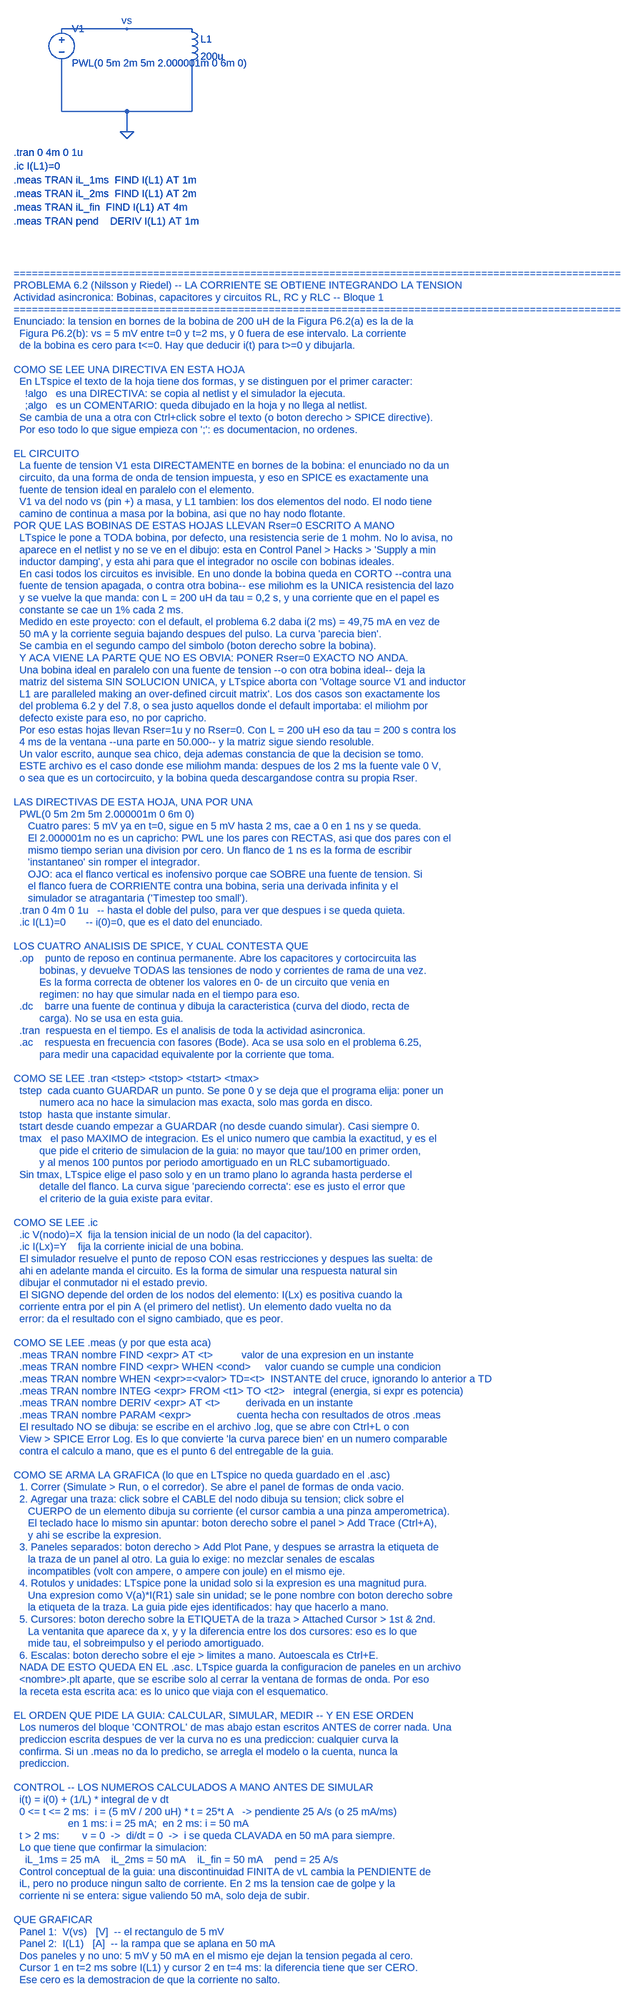
[diagram p0: schematic P6-02_bobina_tension_a_corriente.asc]
P6-02_bobina_tension_a_corriente.asc, the LTspice schematic file:
Version 4
SHEET 1 2000 2600
WIRE 176 112 480 112
WIRE 176 192 176 304
WIRE 480 192 480 304
WIRE 176 304 480 304
WIRE 328 304 328 352
FLAG 328 352 0
FLAG 328 112 vs
SYMBOL voltage 176 96 R0
WINDOW 123 0 0 Left 0
WINDOW 39 0 0 Left 0
SYMATTR InstName V1
SYMATTR Value PWL(0 5m 2m 5m 2.000001m 0 6m 0)
SYMBOL ind 464 96 R0
SYMATTR InstName L1
SYMATTR Value 200u
SYMATTR Value2 Rser=1u
TEXT 64 400 Left 2 !.tran 0 4m 0 1u
TEXT 64 432 Left 2 !.ic I(L1)=0
TEXT 64 464 Left 2 !.meas TRAN iL_1ms  FIND I(L1) AT 1m
TEXT 64 496 Left 2 !.meas TRAN iL_2ms  FIND I(L1) AT 2m
TEXT 64 528 Left 2 !.meas TRAN iL_fin  FIND I(L1) AT 4m
TEXT 64 560 Left 2 !.meas TRAN pend    DERIV I(L1) AT 1m
TEXT 64 900 Left 2 ;====================================================================================================
TEXT 64 928 Left 2 ;PROBLEMA 6.2 (Nilsson y Riedel) -- LA CORRIENTE SE OBTIENE INTEGRANDO LA TENSION
TEXT 64 956 Left 2 ;Actividad asincronica: Bobinas, capacitores y circuitos RL, RC y RLC -- Bloque 1
TEXT 64 984 Left 2 ;====================================================================================================
TEXT 64 1012 Left 2 ;Enunciado: la tension en bornes de la bobina de 200 uH de la Figura P6.2(a) es la de la
TEXT 64 1040 Left 2 ;  Figura P6.2(b): vs = 5 mV entre t=0 y t=2 ms, y 0 fuera de ese intervalo. La corriente
TEXT 64 1068 Left 2 ;  de la bobina es cero para t<=0. Hay que deducir i(t) para t>=0 y dibujarla.
TEXT 64 1096 Left 2 ;
TEXT 64 1124 Left 2 ;COMO SE LEE UNA DIRECTIVA EN ESTA HOJA
TEXT 64 1152 Left 2 ;  En LTspice el texto de la hoja tiene dos formas, y se distinguen por el primer caracter:
TEXT 64 1180 Left 2 ;    !algo   es una DIRECTIVA: se copia al netlist y el simulador la ejecuta.
TEXT 64 1208 Left 2 ;    ;algo   es un COMENTARIO: queda dibujado en la hoja y no llega al netlist.
TEXT 64 1236 Left 2 ;  Se cambia de una a otra con Ctrl+click sobre el texto (o boton derecho > SPICE directive).
TEXT 64 1264 Left 2 ;  Por eso todo lo que sigue empieza con ';': es documentacion, no ordenes.
TEXT 64 1292 Left 2 ;
TEXT 64 1320 Left 2 ;EL CIRCUITO
TEXT 64 1348 Left 2 ;  La fuente de tension V1 esta DIRECTAMENTE en bornes de la bobina: el enunciado no da un
TEXT 64 1376 Left 2 ;  circuito, da una forma de onda de tension impuesta, y eso en SPICE es exactamente una
TEXT 64 1404 Left 2 ;  fuente de tension ideal en paralelo con el elemento.
TEXT 64 1432 Left 2 ;  V1 va del nodo vs (pin +) a masa, y L1 tambien: los dos elementos del nodo. El nodo tiene
TEXT 64 1460 Left 2 ;  camino de continua a masa por la bobina, asi que no hay nodo flotante.
TEXT 64 1488 Left 2 ;POR QUE LAS BOBINAS DE ESTAS HOJAS LLEVAN Rser=0 ESCRITO A MANO
TEXT 64 1516 Left 2 ;  LTspice le pone a TODA bobina, por defecto, una resistencia serie de 1 mohm. No lo avisa, no
TEXT 64 1544 Left 2 ;  aparece en el netlist y no se ve en el dibujo: esta en Control Panel > Hacks > 'Supply a min
TEXT 64 1572 Left 2 ;  inductor damping', y esta ahi para que el integrador no oscile con bobinas ideales.
TEXT 64 1600 Left 2 ;  En casi todos los circuitos es invisible. En uno donde la bobina queda en CORTO --contra una
TEXT 64 1628 Left 2 ;  fuente de tension apagada, o contra otra bobina-- ese miliohm es la UNICA resistencia del lazo
TEXT 64 1656 Left 2 ;  y se vuelve la que manda: con L = 200 uH da tau = 0,2 s, y una corriente que en el papel es
TEXT 64 1684 Left 2 ;  constante se cae un 1% cada 2 ms.
TEXT 64 1712 Left 2 ;  Medido en este proyecto: con el default, el problema 6.2 daba i(2 ms) = 49,75 mA en vez de
TEXT 64 1740 Left 2 ;  50 mA y la corriente seguia bajando despues del pulso. La curva 'parecia bien'.
TEXT 64 1768 Left 2 ;  Se cambia en el segundo campo del simbolo (boton derecho sobre la bobina).
TEXT 64 1796 Left 2 ;  Y ACA VIENE LA PARTE QUE NO ES OBVIA: PONER Rser=0 EXACTO NO ANDA.
TEXT 64 1824 Left 2 ;  Una bobina ideal en paralelo con una fuente de tension --o con otra bobina ideal-- deja la
TEXT 64 1852 Left 2 ;  matriz del sistema SIN SOLUCION UNICA, y LTspice aborta con 'Voltage source V1 and inductor
TEXT 64 1880 Left 2 ;  L1 are paralleled making an over-defined circuit matrix'. Los dos casos son exactamente los
TEXT 64 1908 Left 2 ;  del problema 6.2 y del 7.8, o sea justo aquellos donde el default importaba: el miliohm por
TEXT 64 1936 Left 2 ;  defecto existe para eso, no por capricho.
TEXT 64 1964 Left 2 ;  Por eso estas hojas llevan Rser=1u y no Rser=0. Con L = 200 uH eso da tau = 200 s contra los
TEXT 64 1992 Left 2 ;  4 ms de la ventana --una parte en 50.000-- y la matriz sigue siendo resoluble.
TEXT 64 2020 Left 2 ;  Un valor escrito, aunque sea chico, deja ademas constancia de que la decision se tomo.
TEXT 64 2048 Left 2 ;  ESTE archivo es el caso donde ese miliohm manda: despues de los 2 ms la fuente vale 0 V,
TEXT 64 2076 Left 2 ;  o sea que es un cortocircuito, y la bobina queda descargandose contra su propia Rser.
TEXT 64 2104 Left 2 ;
TEXT 64 2132 Left 2 ;LAS DIRECTIVAS DE ESTA HOJA, UNA POR UNA
TEXT 64 2160 Left 2 ;  PWL(0 5m 2m 5m 2.000001m 0 6m 0)
TEXT 64 2188 Left 2 ;     Cuatro pares: 5 mV ya en t=0, sigue en 5 mV hasta 2 ms, cae a 0 en 1 ns y se queda.
TEXT 64 2216 Left 2 ;     El 2.000001m no es un capricho: PWL une los pares con RECTAS, asi que dos pares con el
TEXT 64 2244 Left 2 ;     mismo tiempo serian una division por cero. Un flanco de 1 ns es la forma de escribir
TEXT 64 2272 Left 2 ;     'instantaneo' sin romper el integrador.
TEXT 64 2300 Left 2 ;     OJO: aca el flanco vertical es inofensivo porque cae SOBRE una fuente de tension. Si
TEXT 64 2328 Left 2 ;     el flanco fuera de CORRIENTE contra una bobina, seria una derivada infinita y el
TEXT 64 2356 Left 2 ;     simulador se atragantaria ('Timestep too small').
TEXT 64 2384 Left 2 ;  .tran 0 4m 0 1u   -- hasta el doble del pulso, para ver que despues i se queda quieta.
TEXT 64 2412 Left 2 ;  .ic I(L1)=0       -- i(0)=0, que es el dato del enunciado.
TEXT 64 2440 Left 2 ;
TEXT 64 2468 Left 2 ;LOS CUATRO ANALISIS DE SPICE, Y CUAL CONTESTA QUE
TEXT 64 2496 Left 2 ;  .op    punto de reposo en continua permanente. Abre los capacitores y cortocircuita las
TEXT 64 2524 Left 2 ;         bobinas, y devuelve TODAS las tensiones de nodo y corrientes de rama de una vez.
TEXT 64 2552 Left 2 ;         Es la forma correcta de obtener los valores en 0- de un circuito que venia en
TEXT 64 2580 Left 2 ;         regimen: no hay que simular nada en el tiempo para eso.
TEXT 64 2608 Left 2 ;  .dc    barre una fuente de continua y dibuja la caracteristica (curva del diodo, recta de
TEXT 64 2636 Left 2 ;         carga). No se usa en esta guia.
TEXT 64 2664 Left 2 ;  .tran  respuesta en el tiempo. Es el analisis de toda la actividad asincronica.
TEXT 64 2692 Left 2 ;  .ac    respuesta en frecuencia con fasores (Bode). Aca se usa solo en el problema 6.25,
TEXT 64 2720 Left 2 ;         para medir una capacidad equivalente por la corriente que toma.
TEXT 64 2748 Left 2 ;
TEXT 64 2776 Left 2 ;COMO SE LEE .tran <tstep> <tstop> <tstart> <tmax>
TEXT 64 2804 Left 2 ;  tstep  cada cuanto GUARDAR un punto. Se pone 0 y se deja que el programa elija: poner un
TEXT 64 2832 Left 2 ;         numero aca no hace la simulacion mas exacta, solo mas gorda en disco.
TEXT 64 2860 Left 2 ;  tstop  hasta que instante simular.
TEXT 64 2888 Left 2 ;  tstart desde cuando empezar a GUARDAR (no desde cuando simular). Casi siempre 0.
TEXT 64 2916 Left 2 ;  tmax   el paso MAXIMO de integracion. Es el unico numero que cambia la exactitud, y es el
TEXT 64 2944 Left 2 ;         que pide el criterio de simulacion de la guia: no mayor que tau/100 en primer orden,
TEXT 64 2972 Left 2 ;         y al menos 100 puntos por periodo amortiguado en un RLC subamortiguado.
TEXT 64 3000 Left 2 ;  Sin tmax, LTspice elige el paso solo y en un tramo plano lo agranda hasta perderse el
TEXT 64 3028 Left 2 ;         detalle del flanco. La curva sigue 'pareciendo correcta': ese es justo el error que
TEXT 64 3056 Left 2 ;         el criterio de la guia existe para evitar.
TEXT 64 3084 Left 2 ;
TEXT 64 3112 Left 2 ;COMO SE LEE .ic
TEXT 64 3140 Left 2 ;  .ic V(nodo)=X  fija la tension inicial de un nodo (la del capacitor).
TEXT 64 3168 Left 2 ;  .ic I(Lx)=Y    fija la corriente inicial de una bobina.
TEXT 64 3196 Left 2 ;  El simulador resuelve el punto de reposo CON esas restricciones y despues las suelta: de
TEXT 64 3224 Left 2 ;  ahi en adelante manda el circuito. Es la forma de simular una respuesta natural sin
TEXT 64 3252 Left 2 ;  dibujar el conmutador ni el estado previo.
TEXT 64 3280 Left 2 ;  El SIGNO depende del orden de los nodos del elemento: I(Lx) es positiva cuando la
TEXT 64 3308 Left 2 ;  corriente entra por el pin A (el primero del netlist). Un elemento dado vuelta no da
TEXT 64 3336 Left 2 ;  error: da el resultado con el signo cambiado, que es peor.
TEXT 64 3364 Left 2 ;
TEXT 64 3392 Left 2 ;COMO SE LEE .meas (y por que esta aca)
TEXT 64 3420 Left 2 ;  .meas TRAN nombre FIND <expr> AT <t>          valor de una expresion en un instante
TEXT 64 3448 Left 2 ;  .meas TRAN nombre FIND <expr> WHEN <cond>     valor cuando se cumple una condicion
TEXT 64 3476 Left 2 ;  .meas TRAN nombre WHEN <expr>=<valor> TD=<t>  INSTANTE del cruce, ignorando lo anterior a TD
TEXT 64 3504 Left 2 ;  .meas TRAN nombre INTEG <expr> FROM <t1> TO <t2>   integral (energia, si expr es potencia)
TEXT 64 3532 Left 2 ;  .meas TRAN nombre DERIV <expr> AT <t>         derivada en un instante
TEXT 64 3560 Left 2 ;  .meas TRAN nombre PARAM <expr>                cuenta hecha con resultados de otros .meas
TEXT 64 3588 Left 2 ;  El resultado NO se dibuja: se escribe en el archivo .log, que se abre con Ctrl+L o con
TEXT 64 3616 Left 2 ;  View > SPICE Error Log. Es lo que convierte 'la curva parece bien' en un numero comparable
TEXT 64 3644 Left 2 ;  contra el calculo a mano, que es el punto 6 del entregable de la guia.
TEXT 64 3672 Left 2 ;
TEXT 64 3700 Left 2 ;COMO SE ARMA LA GRAFICA (lo que en LTspice no queda guardado en el .asc)
TEXT 64 3728 Left 2 ;  1. Correr (Simulate > Run, o el corredor). Se abre el panel de formas de onda vacio.
TEXT 64 3756 Left 2 ;  2. Agregar una traza: click sobre el CABLE del nodo dibuja su tension; click sobre el
TEXT 64 3784 Left 2 ;     CUERPO de un elemento dibuja su corriente (el cursor cambia a una pinza amperometrica).
TEXT 64 3812 Left 2 ;     El teclado hace lo mismo sin apuntar: boton derecho sobre el panel > Add Trace (Ctrl+A),
TEXT 64 3840 Left 2 ;     y ahi se escribe la expresion.
TEXT 64 3868 Left 2 ;  3. Paneles separados: boton derecho > Add Plot Pane, y despues se arrastra la etiqueta de
TEXT 64 3896 Left 2 ;     la traza de un panel al otro. La guia lo exige: no mezclar senales de escalas
TEXT 64 3924 Left 2 ;     incompatibles (volt con ampere, o ampere con joule) en el mismo eje.
TEXT 64 3952 Left 2 ;  4. Rotulos y unidades: LTspice pone la unidad solo si la expresion es una magnitud pura.
TEXT 64 3980 Left 2 ;     Una expresion como V(a)*I(R1) sale sin unidad; se le pone nombre con boton derecho sobre
TEXT 64 4008 Left 2 ;     la etiqueta de la traza. La guia pide ejes identificados: hay que hacerlo a mano.
TEXT 64 4036 Left 2 ;  5. Cursores: boton derecho sobre la ETIQUETA de la traza > Attached Cursor > 1st & 2nd.
TEXT 64 4064 Left 2 ;     La ventanita que aparece da x, y y la diferencia entre los dos cursores: eso es lo que
TEXT 64 4092 Left 2 ;     mide tau, el sobreimpulso y el periodo amortiguado.
TEXT 64 4120 Left 2 ;  6. Escalas: boton derecho sobre el eje > limites a mano. Autoescala es Ctrl+E.
TEXT 64 4148 Left 2 ;  NADA DE ESTO QUEDA EN EL .asc. LTspice guarda la configuracion de paneles en un archivo
TEXT 64 4176 Left 2 ;  <nombre>.plt aparte, que se escribe solo al cerrar la ventana de formas de onda. Por eso
TEXT 64 4204 Left 2 ;  la receta esta escrita aca: es lo unico que viaja con el esquematico.
TEXT 64 4232 Left 2 ;
TEXT 64 4260 Left 2 ;EL ORDEN QUE PIDE LA GUIA: CALCULAR, SIMULAR, MEDIR -- Y EN ESE ORDEN
TEXT 64 4288 Left 2 ;  Los numeros del bloque 'CONTROL' de mas abajo estan escritos ANTES de correr nada. Una
TEXT 64 4316 Left 2 ;  prediccion escrita despues de ver la curva no es una prediccion: cualquier curva la
TEXT 64 4344 Left 2 ;  confirma. Si un .meas no da lo predicho, se arregla el modelo o la cuenta, nunca la
TEXT 64 4372 Left 2 ;  prediccion.
TEXT 64 4400 Left 2 ;
TEXT 64 4428 Left 2 ;CONTROL -- LOS NUMEROS CALCULADOS A MANO ANTES DE SIMULAR
TEXT 64 4456 Left 2 ;  i(t) = i(0) + (1/L) * integral de v dt
TEXT 64 4484 Left 2 ;  0 <= t <= 2 ms:  i = (5 mV / 200 uH) * t = 25*t A   -> pendiente 25 A/s (o 25 mA/ms)
TEXT 64 4512 Left 2 ;                   en 1 ms: i = 25 mA;  en 2 ms: i = 50 mA
TEXT 64 4540 Left 2 ;  t > 2 ms:        v = 0  ->  di/dt = 0  ->  i se queda CLAVADA en 50 mA para siempre.
TEXT 64 4568 Left 2 ;  Lo que tiene que confirmar la simulacion:
TEXT 64 4596 Left 2 ;    iL_1ms = 25 mA    iL_2ms = 50 mA    iL_fin = 50 mA    pend = 25 A/s
TEXT 64 4624 Left 2 ;  Control conceptual de la guia: una discontinuidad FINITA de vL cambia la PENDIENTE de
TEXT 64 4652 Left 2 ;  iL, pero no produce ningun salto de corriente. En 2 ms la tension cae de golpe y la
TEXT 64 4680 Left 2 ;  corriente ni se entera: sigue valiendo 50 mA, solo deja de subir.
TEXT 64 4708 Left 2 ;
TEXT 64 4736 Left 2 ;QUE GRAFICAR
TEXT 64 4764 Left 2 ;  Panel 1:  V(vs)   [V]  -- el rectangulo de 5 mV
TEXT 64 4792 Left 2 ;  Panel 2:  I(L1)   [A]  -- la rampa que se aplana en 50 mA
TEXT 64 4820 Left 2 ;  Dos paneles y no uno: 5 mV y 50 mA en el mismo eje dejan la tension pegada al cero.
TEXT 64 4848 Left 2 ;  Cursor 1 en t=2 ms sobre I(L1) y cursor 2 en t=4 ms: la diferencia tiene que ser CERO.
TEXT 64 4876 Left 2 ;  Ese cero es la demostracion de que la corriente no salto.

The netlist it stands for:
* P6-02_bobina_tension_a_corriente.asc
V1 vs 0 PWL(0 5m 2m 5m 2.000001m 0 6m 0)
L1 vs 0 200u Rser=1u
.tran 0 4m 0 1u
.ic I(L1)=0
.meas TRAN iL_1ms  FIND I(L1) AT 1m
.meas TRAN iL_2ms  FIND I(L1) AT 2m
.meas TRAN iL_fin  FIND I(L1) AT 4m
.meas TRAN pend    DERIV I(L1) AT 1m
* ====================================================================================================
* PROBLEMA 6.2 (Nilsson y Riedel) -- LA CORRIENTE SE OBTIENE INTEGRANDO LA TENSION
* Actividad asincronica: Bobinas, capacitores y circuitos RL, RC y RLC -- Bloque 1
* ====================================================================================================
* Enunciado: la tension en bornes de la bobina de 200 uH de la Figura P6.2(a) es la de la
*   Figura P6.2(b): vs = 5 mV entre t=0 y t=2 ms, y 0 fuera de ese intervalo. La corriente
*   de la bobina es cero para t<=0. Hay que deducir i(t) para t>=0 y dibujarla.
* COMO SE LEE UNA DIRECTIVA EN ESTA HOJA
*   En LTspice el texto de la hoja tiene dos formas, y se distinguen por el primer caracter:
*     !algo   es una DIRECTIVA: se copia al netlist y el simulador la ejecuta.
*     ;algo   es un COMENTARIO: queda dibujado en la hoja y no llega al netlist.
*   Se cambia de una a otra con Ctrl+click sobre el texto (o boton derecho > SPICE directive).
*   Por eso todo lo que sigue empieza con ';': es documentacion, no ordenes.
* EL CIRCUITO
*   La fuente de tension V1 esta DIRECTAMENTE en bornes de la bobina: el enunciado no da un
*   circuito, da una forma de onda de tension impuesta, y eso en SPICE es exactamente una
*   fuente de tension ideal en paralelo con el elemento.
*   V1 va del nodo vs (pin +) a masa, y L1 tambien: los dos elementos del nodo. El nodo tiene
*   camino de continua a masa por la bobina, asi que no hay nodo flotante.
* POR QUE LAS BOBINAS DE ESTAS HOJAS LLEVAN Rser=0 ESCRITO A MANO
*   LTspice le pone a TODA bobina, por defecto, una resistencia serie de 1 mohm. No lo avisa, no
*   aparece en el netlist y no se ve en el dibujo: esta en Control Panel > Hacks > 'Supply a min
*   inductor damping', y esta ahi para que el integrador no oscile con bobinas ideales.
*   En casi todos los circuitos es invisible. En uno donde la bobina queda en CORTO --contra una
*   fuente de tension apagada, o contra otra bobina-- ese miliohm es la UNICA resistencia del lazo
*   y se vuelve la que manda: con L = 200 uH da tau = 0,2 s, y una corriente que en el papel es
*   constante se cae un 1% cada 2 ms.
*   Medido en este proyecto: con el default, el problema 6.2 daba i(2 ms) = 49,75 mA en vez de
*   50 mA y la corriente seguia bajando despues del pulso. La curva 'parecia bien'.
*   Se cambia en el segundo campo del simbolo (boton derecho sobre la bobina).
*   Y ACA VIENE LA PARTE QUE NO ES OBVIA: PONER Rser=0 EXACTO NO ANDA.
*   Una bobina ideal en paralelo con una fuente de tension --o con otra bobina ideal-- deja la
*   matriz del sistema SIN SOLUCION UNICA, y LTspice aborta con 'Voltage source V1 and inductor
*   L1 are paralleled making an over-defined circuit matrix'. Los dos casos son exactamente los
*   del problema 6.2 y del 7.8, o sea justo aquellos donde el default importaba: el miliohm por
*   defecto existe para eso, no por capricho.
*   Por eso estas hojas llevan Rser=1u y no Rser=0. Con L = 200 uH eso da tau = 200 s contra los
*   4 ms de la ventana --una parte en 50.000-- y la matriz sigue siendo resoluble.
*   Un valor escrito, aunque sea chico, deja ademas constancia de que la decision se tomo.
*   ESTE archivo es el caso donde ese miliohm manda: despues de los 2 ms la fuente vale 0 V,
*   o sea que es un cortocircuito, y la bobina queda descargandose contra su propia Rser.
* LAS DIRECTIVAS DE ESTA HOJA, UNA POR UNA
*   PWL(0 5m 2m 5m 2.000001m 0 6m 0)
*      Cuatro pares: 5 mV ya en t=0, sigue en 5 mV hasta 2 ms, cae a 0 en 1 ns y se queda.
*      El 2.000001m no es un capricho: PWL une los pares con RECTAS, asi que dos pares con el
*      mismo tiempo serian una division por cero. Un flanco de 1 ns es la forma de escribir
*      'instantaneo' sin romper el integrador.
*      OJO: aca el flanco vertical es inofensivo porque cae SOBRE una fuente de tension. Si
*      el flanco fuera de CORRIENTE contra una bobina, seria una derivada infinita y el
*      simulador se atragantaria ('Timestep too small').
*   .tran 0 4m 0 1u   -- hasta el doble del pulso, para ver que despues i se queda quieta.
*   .ic I(L1)=0       -- i(0)=0, que es el dato del enunciado.
* LOS CUATRO ANALISIS DE SPICE, Y CUAL CONTESTA QUE
*   .op    punto de reposo en continua permanente. Abre los capacitores y cortocircuita las
*          bobinas, y devuelve TODAS las tensiones de nodo y corrientes de rama de una vez.
*          Es la forma correcta de obtener los valores en 0- de un circuito que venia en
*          regimen: no hay que simular nada en el tiempo para eso.
*   .dc    barre una fuente de continua y dibuja la caracteristica (curva del diodo, recta de
*          carga). No se usa en esta guia.
*   .tran  respuesta en el tiempo. Es el analisis de toda la actividad asincronica.
*   .ac    respuesta en frecuencia con fasores (Bode). Aca se usa solo en el problema 6.25,
*          para medir una capacidad equivalente por la corriente que toma.
* COMO SE LEE .tran <tstep> <tstop> <tstart> <tmax>
*   tstep  cada cuanto GUARDAR un punto. Se pone 0 y se deja que el programa elija: poner un
*          numero aca no hace la simulacion mas exacta, solo mas gorda en disco.
*   tstop  hasta que instante simular.
*   tstart desde cuando empezar a GUARDAR (no desde cuando simular). Casi siempre 0.
*   tmax   el paso MAXIMO de integracion. Es el unico numero que cambia la exactitud, y es el
*          que pide el criterio de simulacion de la guia: no mayor que tau/100 en primer orden,
*          y al menos 100 puntos por periodo amortiguado en un RLC subamortiguado.
*   Sin tmax, LTspice elige el paso solo y en un tramo plano lo agranda hasta perderse el
*          detalle del flanco. La curva sigue 'pareciendo correcta': ese es justo el error que
*          el criterio de la guia existe para evitar.
* COMO SE LEE .ic
*   .ic V(nodo)=X  fija la tension inicial de un nodo (la del capacitor).
*   .ic I(Lx)=Y    fija la corriente inicial de una bobina.
*   El simulador resuelve el punto de reposo CON esas restricciones y despues las suelta: de
*   ahi en adelante manda el circuito. Es la forma de simular una respuesta natural sin
*   dibujar el conmutador ni el estado previo.
*   El SIGNO depende del orden de los nodos del elemento: I(Lx) es positiva cuando la
*   corriente entra por el pin A (el primero del netlist). Un elemento dado vuelta no da
*   error: da el resultado con el signo cambiado, que es peor.
* COMO SE LEE .meas (y por que esta aca)
*   .meas TRAN nombre FIND <expr> AT <t>          valor de una expresion en un instante
*   .meas TRAN nombre FIND <expr> WHEN <cond>     valor cuando se cumple una condicion
*   .meas TRAN nombre WHEN <expr>=<valor> TD=<t>  INSTANTE del cruce, ignorando lo anterior a TD
*   .meas TRAN nombre INTEG <expr> FROM <t1> TO <t2>   integral (energia, si expr es potencia)
*   .meas TRAN nombre DERIV <expr> AT <t>         derivada en un instante
*   .meas TRAN nombre PARAM <expr>                cuenta hecha con resultados de otros .meas
*   El resultado NO se dibuja: se escribe en el archivo .log, que se abre con Ctrl+L o con
*   View > SPICE Error Log. Es lo que convierte 'la curva parece bien' en un numero comparable
*   contra el calculo a mano, que es el punto 6 del entregable de la guia.
* COMO SE ARMA LA GRAFICA (lo que en LTspice no queda guardado en el .asc)
*   1. Correr (Simulate > Run, o el corredor). Se abre el panel de formas de onda vacio.
*   2. Agregar una traza: click sobre el CABLE del nodo dibuja su tension; click sobre el
*      CUERPO de un elemento dibuja su corriente (el cursor cambia a una pinza amperometrica).
*      El teclado hace lo mismo sin apuntar: boton derecho sobre el panel > Add Trace (Ctrl+A),
*      y ahi se escribe la expresion.
*   3. Paneles separados: boton derecho > Add Plot Pane, y despues se arrastra la etiqueta de
*      la traza de un panel al otro. La guia lo exige: no mezclar senales de escalas
*      incompatibles (volt con ampere, o ampere con joule) en el mismo eje.
*   4. Rotulos y unidades: LTspice pone la unidad solo si la expresion es una magnitud pura.
*      Una expresion como V(a)*I(R1) sale sin unidad; se le pone nombre con boton derecho sobre
*      la etiqueta de la traza. La guia pide ejes identificados: hay que hacerlo a mano.
*   5. Cursores: boton derecho sobre la ETIQUETA de la traza > Attached Cursor > 1st & 2nd.
*      La ventanita que aparece da x, y y la diferencia entre los dos cursores: eso es lo que
*      mide tau, el sobreimpulso y el periodo amortiguado.
*   6. Escalas: boton derecho sobre el eje > limites a mano. Autoescala es Ctrl+E.
*   NADA DE ESTO QUEDA EN EL .asc. LTspice guarda la configuracion de paneles en un archivo
*   <nombre>.plt aparte, que se escribe solo al cerrar la ventana de formas de onda. Por eso
*   la receta esta escrita aca: es lo unico que viaja con el esquematico.
* EL ORDEN QUE PIDE LA GUIA: CALCULAR, SIMULAR, MEDIR -- Y EN ESE ORDEN
*   Los numeros del bloque 'CONTROL' de mas abajo estan escritos ANTES de correr nada. Una
*   prediccion escrita despues de ver la curva no es una prediccion: cualquier curva la
*   confirma. Si un .meas no da lo predicho, se arregla el modelo o la cuenta, nunca la
*   prediccion.
* CONTROL -- LOS NUMEROS CALCULADOS A MANO ANTES DE SIMULAR
*   i(t) = i(0) + (1/L) * integral de v dt
*   0 <= t <= 2 ms:  i = (5 mV / 200 uH) * t = 25*t A   -> pendiente 25 A/s (o 25 mA/ms)
*                    en 1 ms: i = 25 mA;  en 2 ms: i = 50 mA
*   t > 2 ms:        v = 0  ->  di/dt = 0  ->  i se queda CLAVADA en 50 mA para siempre.
*   Lo que tiene que confirmar la simulacion:
*     iL_1ms = 25 mA    iL_2ms = 50 mA    iL_fin = 50 mA    pend = 25 A/s
*   Control conceptual de la guia: una discontinuidad FINITA de vL cambia la PENDIENTE de
*   iL, pero no produce ningun salto de corriente. En 2 ms la tension cae de golpe y la
*   corriente ni se entera: sigue valiendo 50 mA, solo deja de subir.
* QUE GRAFICAR
*   Panel 1:  V(vs)   [V]  -- el rectangulo de 5 mV
*   Panel 2:  I(L1)   [A]  -- la rampa que se aplana en 50 mA
*   Dos paneles y no uno: 5 mV y 50 mA en el mismo eje dejan la tension pegada al cero.
*   Cursor 1 en t=2 ms sobre I(L1) y cursor 2 en t=4 ms: la diferencia tiene que ser CERO.
*   Ese cero es la demostracion de que la corriente no salto.
.backanno
.end